# EAGLE design ESP8266-Engine (EAGLE 8.4.0)
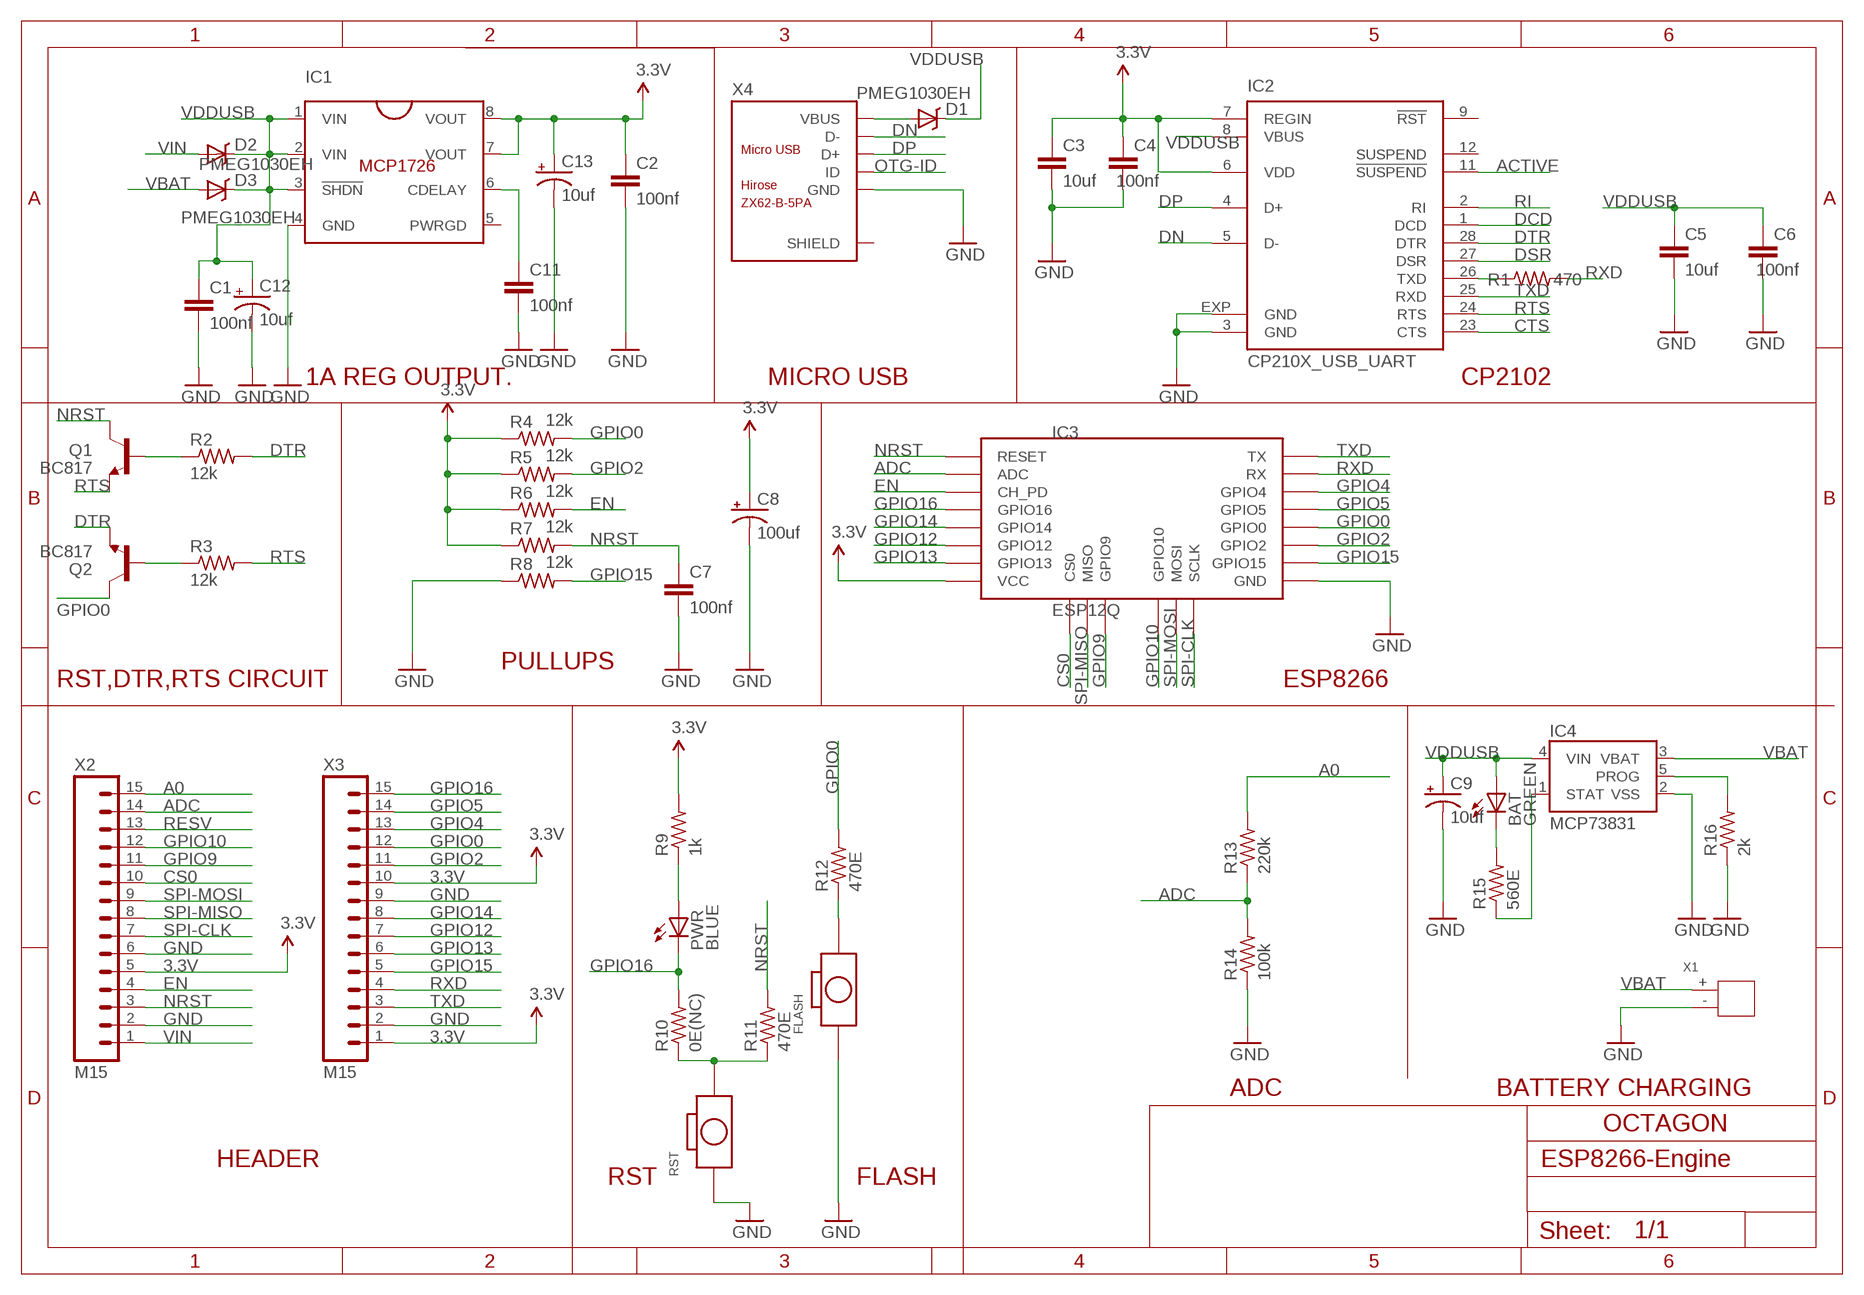
[diagram p0: schematic, sheet 1]

## Parts
BAT  GREEN  LED0603  [LED-0603]
C1  100nf  C-EUC0402  [C0402]
C2  100nf  C-EUC0402  [C0402]
C3  10uf  CAPACITOR-NONPOLARIZEDSMD  [C0603]
C4  100nf  C-EUC0402  [C0402]
C5  10uf  CAPACITOR-NONPOLARIZEDSMD  [C0603]
C6  100nf  C-EUC0402  [C0402]
C7  100nf  C-EUC0402  [C0402]
C8  100uf  CAPACITOR_POLARIZED1206  [EIA3216]
C9  10uf  CAPACITOR_POLARIZED1206  [EIA3216]
C11  100nf  C-EUC0402  [C0402]
C12  10uf  CAPACITOR_POLARIZED1206  [EIA3216]
C13  10uf  CAPACITOR_POLARIZED1206  [EIA3216]
D1  PMEG1030EH  SCHOTTKYDIODEDIOB  [MINIMELF]
D2  PMEG1030EH  SCHOTTKYDIODEDIOB  [MINIMELF]
D3  PMEG1030EH  SCHOTTKYDIODEDIOB  [MINIMELF]
FLASH  SMD-BUTTON-WITHOUT-BOSS-(2P-3X2.5MM)  [SW2-SMD-3.0X2.5X1.2+0.4MM]
IC1  MCP1726  [SOIC8]
IC2  CP210X_USB_UART  [MLP28]
IC3  ESP12Q  [ESP12Q]
IC4  MCP73831  [SOT23-5]
PWR  BLUE  LED0603  [LED-0603]
Q1  BC817  TRANSISTOR_NPNSOT23  [SOT23]
Q2  BC817  TRANSISTOR_NPNSOT23  [SOT23]
R1  470  R-US_R0402  [R0402]
R2  12k  R-US_R0402  [R0402]
R3  12k  R-US_R0402  [R0402]
R4  12k  R-US_R0402  [R0402]
R5  12k  R-US_R0402  [R0402]
R6  12k  R-US_R0402  [R0402]
R7  12k  R-US_R0402  [R0402]
R8  12k  R-US_R0402  [R0402]
R9  1k  R-US_R0402  [R0402]
R10  0E(NC)  R-US_R0402  [R0402]
R11  470E  R-US_R0402  [R0402]
R12  470E  R-US_R0402  [R0402]
R13  220k  R-US_R0402  [R0402]
R14  100k  R-US_R0402  [R0402]
R15  560E  R-US_R0402  [R0402]
R16  2k  R-US_R0402  [R0402]
RST  SMD-BUTTON-WITHOUT-BOSS-(2P-3X2.5MM)  [SW2-SMD-3.0X2.5X1.2+0.4MM]
X1  DIP-JST-2P-2.0  [H2-2.0-6X4.5MM]
X2  M15  [1X15]
X3  M15  [1X15]
X4  MICRO-USB-SMD(ZX62-B-5PA)  [MICRO-USB5+6P-SMD-0.65-AB]

## Nets
3.3V: C2.1 C3.1 C4.1 C8.A(+) C13.A(+) IC1.7(VOUT) IC1.8(VOUT) IC2.6(VDD) IC2.7(REGIN) IC3.VCC R4.1 R5.1 R6.1 R7.1 R9.2 X2.5 X3.1 X3.10
A0: R13.2 X2.15
ACTIVE: IC2.11(!SUSPEND)
ADC: IC3.ADC R13.1 R14.2 X2.14
CS0: IC3.CS0 X2.10
CTS: IC2.23(CTS)
DCD: IC2.1(DCD)
DN: IC2.5(D-) X4.2(D-)
DP: IC2.4(D+) X4.3(D+)
DSR: IC2.27(DSR)
DTR: IC2.28(DTR) Q2.2(E) R2.2
EN: IC3.EN(CH_PD) R6.2 X2.4
GND: C1.2 C2.2 C3.2 C4.2 C5.2 C6.2 C7.2 C8.C(-) C9.C(-) C11.2 C12.C(-) C13.C(-) FLASH.1 IC1.4(GND) IC2.3(GND) IC2.EXP(GND) IC3.GND IC4.2(VSS) R8.1 R14.1 R16.1 RST.1 X1.- X2.2 X2.6 X3.2 X3.9 X4.5(GND)
GPIO0: IC3.GPIO0 Q2.3(C) R4.2 R12.2 X3.12
GPIO2: IC3.GPIO2 R5.2 X3.11
GPIO4: IC3.GPIO4 X3.13
GPIO5: IC3.GPIO5 X3.14
GPIO9: IC3.GPIO9 X2.11
GPIO10: IC3.GPIO10 X2.12
GPIO12: IC3.GPIO12 X3.7
GPIO13: IC3.GPIO13 X3.6
GPIO14: IC3.GPIO14 X3.8
GPIO15: IC3.GPIO15 R8.2 X3.5
GPIO16: IC3.GPIO16 PWR.C R10.2 X3.15
N$1: Q1.1(B) R2.1
N$2: IC2.26(TXD) R1.1
N$3: Q2.1(B) R3.1
N$4: BAT.C R15.2
N$5: IC4.1(STAT) R15.1
N$6: FLASH.2 R12.1
N$8: PWR.A R9.1
N$10: R10.1 R11.1 RST.2
N$11: IC4.5(PROG) R16.2
N$15: C11.1 IC1.6(CDELAY)
NRST: C7.1 IC3.RESET Q1.3(C) R7.2 R11.2 X2.3
OTG-ID: X4.4(ID)
RESV: X2.13
RI: IC2.2(RI)
RTS: IC2.24(RTS) Q1.2(E) R3.2
RXD: IC3.RX R1.2 X3.4
SPI-CLK: IC3.SCLK X2.7
SPI-MISO: IC3.MISO X2.8
SPI-MOSI: IC3.MOSI X2.9
TXD: IC2.25(RXD) IC3.TX X3.3
VBAT: D3.A IC4.3(VBAT) X1.+
VBUS: D1.A X4.1(VBUS)
VDDUSB: BAT.A C1.1 C5.1 C6.1 C9.A(+) C12.A(+) D1.K(C) D2.K(C) D3.K(C) IC1.1(VIN) IC1.2(VIN) IC1.3(!SHDN) IC2.8(VBUS) IC4.4(VIN)
VIN: D2.A X2.1
Unconnected: IC1.5(PWRGD) IC2.9(!RST) IC2.12(SUSPEND) X4.P1(SHIELD) X4.P2(SHIELD) X4.P3(SHIELD) X4.P4(SHIELD) X4.P5(SHIELD) X4.P6(SHIELD)

## Notes on the sheet
- 1A REG OUTPUT. | MICRO USB | CP2102
- PULLUPS
- RST,DTR,RTS CIRCUIT | ESP8266
- ADC | BATTERY CHARGING
- OCTAGON
- HEADER
- RST | FLASH

## Library data of the parts
BAT PWR = Entesla-lib-Aug2010:LED: LEDs Standard schematic elements and footprints for 5mm, 3mm, 1206, and 0603 sized LEDs. 5mm - Spark Fun Electronics SKU : COM-00529 (and others)
C1 C2 C4 C6 C7 C11 = rcl:C-EU: CAPACITOR, European symbol
C3 C5 = Entesla_Kanni:CAPACITOR-NONPOLARIZED: CAPACITOR, European symbol,Non Polarized Capacitors
C8 C9 C12 C13 = Entesla_Kanni:CAPACITOR_POLARIZED: Capacitor Polarized These are commonly used SMD and PTH capacitors. Verify the external diameter of the through hole, as it may vary with manufacturer.
D1-D3 = Entesla_Kanni:SCHOTTKYDIODE: SCHOTTKY DIODE
FLASH RST = Seeed-OPL-Button:SMD-BUTTON-WITHOUT-BOSS-(2P-3X2.5MM): 311020047; MPN: B3U-1000P
IC1 = Entesla_Kanni:MCP1726
IC2 = Entesla_Kanni:CP210X_USB_UART: Single-Chip USB to UART Bridge Source: www.silabs.com .. CP2101.pdf / cp2102.pdf.
IC3 = esp826612q:ESP12Q: ESP8266 Wifi module 12-Q
IC4 = SparkFun-PowerIC:MCP73831: Miniature single cell, fully integrated Li-Ion, Li-polymer charge management controller http://ww1.microchip.com/downloads/en/DeviceDoc/21984a.pdf IC-09995; PROD_ID: IC-09995
Q1 Q2 = Entesla_Kanni:TRANSISTOR_NPN: Transistor NPN BJT configuration in SOT23 package. MMBT2222 is the common NPN we use. Double check BCE configuration again layout.
R1-R16 = Entesla_Kanni:R-US_: RESISTOR, American symbol
X1 = Seeed-OPL-Connector:DIP-JST-2P-2.0: 320110049
X2 X3 = male connector:M15: Header 15 Standard 15-pin 0.1" header. Use with straight break away headers (SKU : PRT-00116), right angle break away headers (PRT-00553), swiss pins (PRT-00743), machine pins (PRT-00117), and female headers (PRT-00115).
X4 = Seeed-OPL-Connector:MICRO-USB-SMD(ZX62-B-5PA): 320010005

## Board
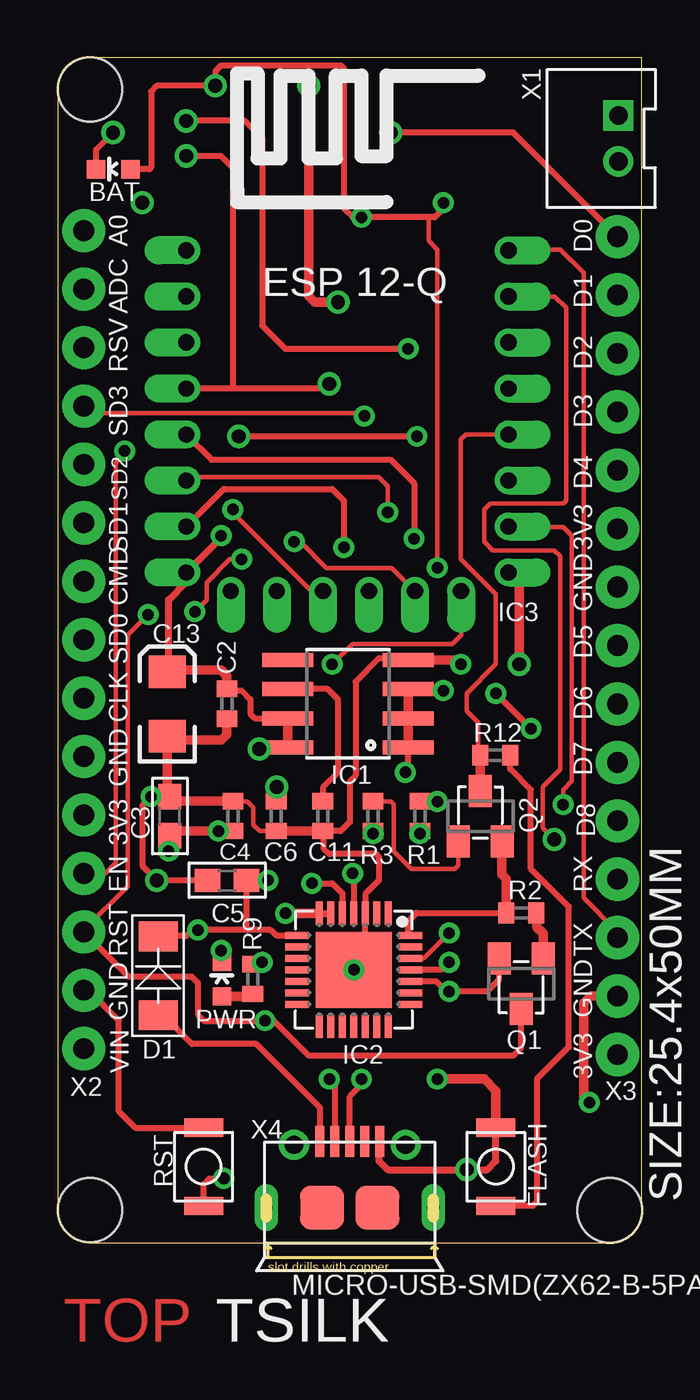
[diagram p1: board, top side]
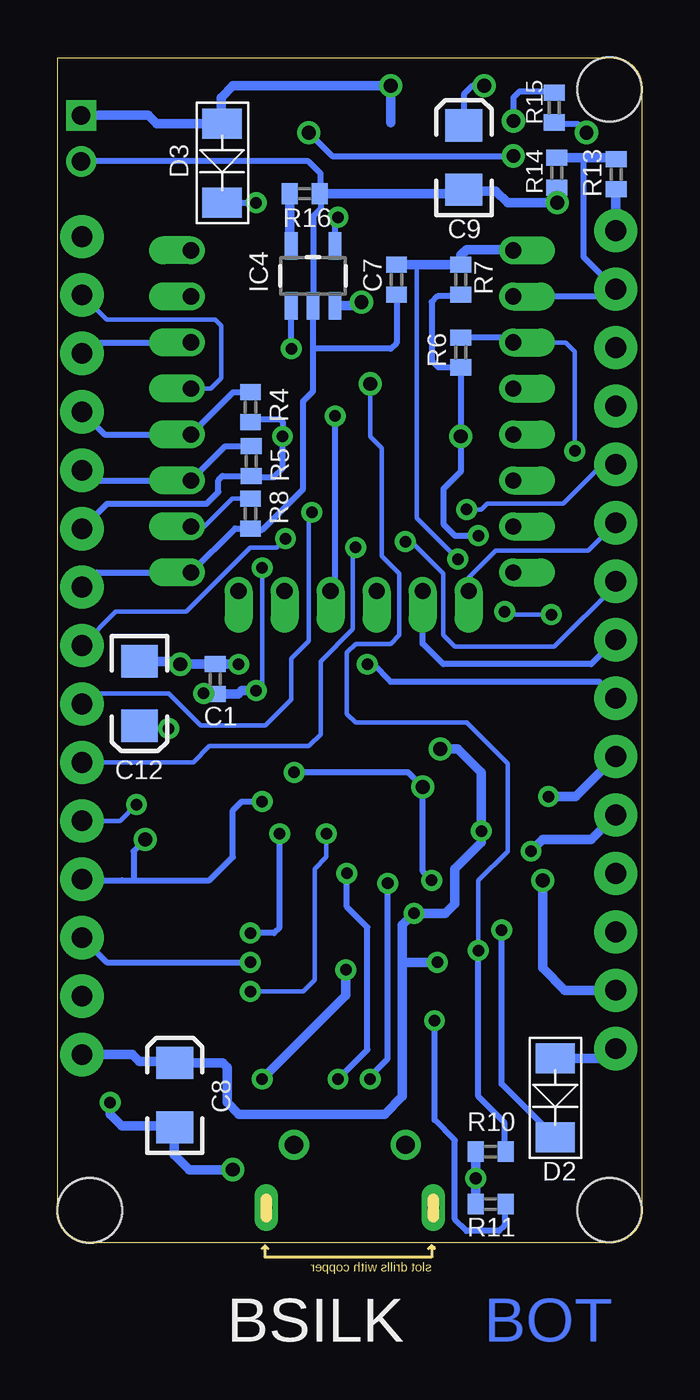
[diagram p2: board, bottom side, seen from below]

Size 25.4 x 51.52 mm. Coordinates in mm from the lower left corner, seen from the top.
Outline: 0,50.23 0,1.37 arc90 1.37,0 24.05,0 arc90 25.4,1.35 25.4,51.52 1.29,51.52 arc90 0,50.23
Copper layers (1*16): Top 0.035mm / dielectric 1.5mm / Bottom 0.035mm
Design rules "default": minimum track width 10mil, minimum drill 24mil, track to track 8mil, track to pad 8mil, pad to pad 8mil, via to via 8mil, smd to smd 8mil, copper to edge 40mil, drill to drill 8mil, minimum pad ring 10mil, minimum via ring 8mil, stop-mask expansion 4mil, vias tented up to drill 0mil, thermal gap 10mil
Holes 2.8 mm at 24,1.41 1.41,1.42 1.41,50.14

### Footprints (pad centres in the part's own frame; a part is rotated, then mirrored left to right if it is on the bottom)
LED-0603 = smd 0.8 x 0.8: A 0,-0.75; C 0,0.75
C0402 = smd 0.7 x 0.9: 1 -0.65,0; 2 0.65,0
C0603 = smd 1.1 x 1: 1 -0.85,0; 2 0.85,0
EIA3216 = smd 1.4 x 1.6: A 1.4,0; C -1.4,0
MINIMELF = smd 1.3 x 1.7: A 0.749,0.953; K 4.178,0.953
SW2-SMD-3.0X2.5X1.2+0.4MM = smd 0.8 x 1.7: 1 -1.7,0; 2 1.7,0
SOIC8 = smd 0.61 x 2.21: 1 -1.905,-2.616; 2 -0.635,-2.616; 3 0.635,-2.616; 4 1.905,-2.616; 5 1.905,2.616; 6 0.635,2.616; 7 -0.635,2.616; 8 -1.905,2.616
MLP28 = smd 1.016 x 0.3: 1 0.081,4.04; 2 0.081,3.54; 3 0.081,3.04; 4 0.081,2.54; 5 0.081,2.04; 6 0.081,1.54; 7 0.081,1.04; 15 4.999,1.04; 16 4.999,1.54; 17 4.999,2.04; 18 4.999,2.54; 19 4.999,3.04; 20 4.999,3.54; 21 4.999,4.04 | smd 0.3 x 1.016: 8 1.04,0.081; 9 1.54,0.081; 10 2.04,0.081; 11 2.54,0.081; 12 3.04,0.081; 13 3.54,0.081; 14 4.04,0.081; 22 4.04,4.999; 23 3.54,4.999; 24 3.04,4.999; 25 2.54,4.999; 26 2.04,4.999; 27 1.54,4.999; 28 1.04,4.999 | smd 3.3 x 3.302: EXP 2.54,2.54
ESP12Q = drill 0.7 offset: ADC -7.1,3.8; CS0 -5.165,-9.005; EN -7.1,1.8; GND 6.9,-8.2; GPIO0 6.9,-2.2; GPIO2 6.9,-4.2; GPIO4 6.9,1.8; GPIO5 6.9,-0.2; GPIO9 -1.165,-9.005; GPIO10 0.835,-9.005; GPIO12 -7.1,-4.2; GPIO13 -7.1,-6.2; GPIO14 -7.1,-2.2; GPIO15 6.9,-6.2; GPIO16 -7.1,-0.2; MISO -3.165,-9.005; MOSI 2.835,-9.005; RESET -7.1,5.8; RX 6.9,3.8; SCLK 4.835,-9.005; TX 6.9,5.8; VCC -7.1,-8.2
SOT23-5 = smd 0.55 x 1.2: 1 -0.95,-1.3; 2 0,-1.3; 3 0.95,-1.3; 4 0.95,1.3; 5 -0.95,1.3
SOT23 = smd 1 x 1.4: 1 -0.95,-1.1; 2 0.95,-1.1; 3 0,1.1
R0402 = smd 0.7 x 0.9: 1 -0.65,0; 2 0.65,0
H2-2.0-6X4.5MM = drill 0.8 pad 1.3 square: + -1,0.75 | drill 0.8 pad 1.3: - 1,0.75
1X15 = drill 0.9 pad 1.88: 1 0,0; 2 2.54,0; 3 5.08,0; 4 7.62,0; 5 10.16,0; 6 12.7,0; 7 15.24,0; 8 17.78,0; 9 20.32,0; 10 22.86,0; 11 25.4,0; 12 27.94,0; 13 30.48,0; 14 33.02,0; 15 35.56,0
MICRO-USB5+6P-SMD-0.65-AB = smd 0.4 x 1.35: 1 -1.3,2.875; 2 -0.65,2.875; 3 0,2.875; 4 0.65,2.875; 5 1.3,2.875 | smd 1.9 x 1.9: P1 -1.2,0; P2 1.2,0 | drill 0.508 pad 1.016 long: P3 -3.625,0; P4 3.625,0 | drill 0.8: P5 -2.425,2.73; P6 2.425,2.73

### Placement (x,y rotation side)
BAT  2.42,46.66 90 top
C1  18.54,24.51 90 bottom
C2  7.36,23.43 270 top
C3  4.88,18.54 90 top
C4  7.62,18.54 90 top
C5  7.37,15.75 180 top
C6  9.51,18.54 270 top
C7  10.67,41.86 270 bottom
C8  20.31,6.41 90 bottom
C9  7.74,47.17 90 bottom
C11  11.53,18.54 270 top
C12  21.83,23.88 270 bottom
C13  4.77,23.42 90 top
D1  5.33,9.14 90 top
D2  4.73,8.76 270 bottom
D3  19.2,49.4 270 bottom
FLASH  19.05,3.3 270 top
IC1  12.62,23.43 90 top
IC2  10.33,14.4 270 top
IC3  12.7,37.34 0 top
IC4  14.3,42.03 0 bottom
PWR  7.14,11.46 0 top
Q1  20.15,11.26 180 top
Q2  18.37,18.54 0 top
R1  15.75,18.54 90 top
R2  20.15,14.34 180 top
R3  13.72,18.54 270 top
R4  17.02,36.32 90 bottom
R5  16.98,33.98 90 bottom
R6  7.87,38.7 90 bottom
R7  7.87,41.86 90 bottom
R8  17.02,31.7 90 bottom
R9  8.49,11.46 90 top
R10  6.58,3.96 0 bottom
R11  6.58,1.67 0 bottom
R12  19.02,21.19 180 top
R13  1.12,46.45 270 bottom
R14  3.71,46.51 90 bottom
R15  3.81,49.35 270 bottom
R16  14.66,45.6 180 bottom
RST  6.35,3.3 270 top
X1  23.62,48.01 270 top
X2  1.14,8.43 90 top
X3  24.33,8.18 90 top
X4  12.7,1.52 0 top

### Tracks (layer width: path | path; a pad name or v marks a point on that pad's centre or on a via)
3.3V  (via drill 0.5, 0.6)
  Top 0.203: 7.11,30.65 v7.11,30.73
  Top 0.254: IC2.7 | C13.A 4.84,24.89 4.83,24.91 | R9.2 8.57,12.19 | IC1.8 9.95,21.46 | v15.62,35.05 v7.87,35.05 | C2.1 7.44,24 8,24 8.38,23.62 8.38,22.99 8.57,22.8 IC1.7
  Top 0.305: C3.1 5.08,17.89 | IC2.7 IC2.6 | 4.83,24.91 4.83,27.94 5.6,28.71 IC3.VCC 7.11,30.65
  Top 0.406: 5.08,17.89 v6.99,17.89 C4.1 | v9.91,14.32 IC2.7 | IC1.8 IC1.7 | 4.84,24.89 7.11,24.89 7.36,24.64 C2.1 | 8.57,12.19 v8.89,12.19 | 9.95,21.46 v8.76,21.46 | v4.83,17.02 4.88,17.07 C3.1
  Bottom 0.203: R4.1 16.88,35.81 | R5.1 16.93,33.27
  Bottom 0.254: X3.10 23.24,32.13 18.92,32.13 18.41,32.64 18.41,33.15 18.23,33.33 R5.1 | R7.1 7.94,41.15 8.89,41.15 9.14,40.89 9.14,38.35 8.84,38.05 R6.1 v7.87,35.05 7.87,33.53 8.64,32.77 8.64,31.24 8.13,30.73 v7.11,30.73 | 16.88,35.81 15.75,35.81 15.62,35.69 v15.62,35.05 15.62,33.66 16,33.27 16.93,33.27
  Bottom 0.406: 10.41,12.19 10.41,6.35 11.18,5.59 17.53,5.59 18.03,6.1 18.03,7.62 18.23,7.81 C8.A 20.37,7.87 21.84,7.87 22.15,8.18 X3.1 | v8.89,12.19 10.41,12.19 | v8.76,21.46 8,21.46 6.99,20.45 v6.99,17.89 6.99,17.4 8.13,16.26 8.13,14.73 8.54,14.32 v9.91,14.32 10.41,13.81 10.41,12.19 | X2.5 2.21,17.53 4.32,17.53 v4.83,17.02
A0
  Bottom 0.406: R13.2 1.14,45.78 X2.15
ADC
  Bottom 0.254: IC3.ADC 1.46,41.14 X2.14 2.54,42.85 2.54,47.16
  Bottom 0.406: R13.1 1.18,47.16 2.54,47.16 R14.2
CS0
  Bottom 0.203: X2.10 2.34,30.1 6.35,30.1 7.54,28.91 IC3.CS0
DN  (via drill 0.5)
  Top 0.254: 12.06,4.41 X4.2 12.05,6.87 v11.81,7.11 | IC2.5 12.37,15.19 11.94,15.62 v11.05,15.62
  Bottom 0.254: v11.05,15.62 11.05,8 11.81,7.24 v11.81,7.11
DP  (via drill 0.5)
  Top 0.254: X4.3 12.7,6.35 13.21,6.86 v13.21,7.11 | IC2.4 12.87,16.08 12.85,16.05 v12.83,16.05
  Bottom 0.254: v13.21,7.11 11.94,8.38 11.94,13.72 12.83,14.61 v12.83,16.05
DTR
  Top 0.254: Q2.2 19.3,17.42 | IC2.28 15.24,13.46 15.24,13.97 15.61,14.34 R2.2
  Top 0.406: 19.3,17.42 19.3,16 19.5,15.8 R2.2
EN  (via drill 0.5)
  Top 0.203: X2.4 2.08,16.05 2.54,16.51 2.54,33.91 2.92,34.29 v2.92,34.42
  Bottom 0.203: v2.92,34.42 2.92,38.73 3.32,39.14 IC3.EN
  Bottom 0.254: R6.2 5.82,39.35 IC3.EN
GND  (via drill 0.5, 0.6)
  Top 0.203: 7.63,19.18 8.26,19.18 8.51,18.92 8.51,18.16 8.78,17.89 C6.2
  Top 0.254: 4.77,19.5 C3.2 v4.06,19.39 3.68,19.01 3.68,16.38 v4.32,15.75 C5.2 | C13.C 4.95,21.84 | IC2.EXP 13.37,12.36 IC2.3 13.37,15.15 13.97,15.75 13.97,16.76 13.84,16.89 11.81,16.89 11.56,17.14 11.56,17.86 C11.2 12.3,17.89 12.7,18.29 12.7,20.07 12.95,20.32 12.95,24.38 13.97,25.4 15.18,25.4 IC1.4 | C4.2 7.63,19.18 | X2.2 1.35,10.97 2.67,9.65 2.67,5.71 3.38,5 RST.1
  Top 0.305: C3.2 5.08,19.19 | X4.5 13.97,4.37 13.97,3.56 14.35,3.17 v17.78,3.17 18.67,3.17 19.05,3.56 FLASH.1
  Top 0.406: 5.08,19.19 C4.2 | C11.2 C6.2 | 4.77,19.5 C13.C | 4.95,21.84 7.11,21.84 7.36,22.09 C2.2 | v16.51,7.11 18.54,7.11 19.05,6.6 FLASH.1 | X3.2 23.16,10.72 22.86,10.41 22.86,6.35 v23.11,6.1 | v17.53,25.15 17.34,25.34 IC1.4 | IC3.GND 20.07,28.67 v20.07,25.15
  Bottom 0.203: C1.2 18.55,25.15 | R8.1 16.95,30.99
  Bottom 0.254: C7.2 10.67,39.12 10.92,38.86 14.3,38.86 | 14.3,38.86 IC4.2 14.3,44.63 13.97,44.96 13.97,45.56 R16.1 13.97,45.64 13.97,46.48 14.49,47.01 X1.- | C1.2 18.53,25.15 | C9.C 7.69,45.72 | X3.9 23.69,29.14 IC3.GND 17.69,31.05 R8.1 | 16.95,30.99 16.51,30.99 14.73,32.77 14.73,36.58 14.3,37.01 14.3,38.86
  Bottom 0.406: v16.51,7.11 12.87,10.75 IC2.EXP | 18.53,25.15 v17.53,25.15 | X2.6 2.88,19.39 v4.06,19.39 | v4.32,15.75 4.32,11.94 3.35,10.97 X2.2 | 18.55,25.15 v20.07,25.15 20.2,25.28 C12.C | 7.69,45.72 6.35,45.72 5.84,45.21 v3.68,45.21 3.68,45.84 R14.1 | v17.78,3.17 19.68,3.17 20.32,3.81 C8.C 20.38,5.08 22.61,5.08 23.11,5.59 v23.11,6.1 | C9.C 7.91,45.6 R16.1
  other vias: 12.87,11.86
GPIO0
  Top 0.203: R12.2 18.29,21.27 18.29,22.61 17.78,23.11 17.78,23.88 19.05,25.15 19.05,28.19 17.53,29.72 17.53,34.92 17.74,35.14 IC3.GPIO0
  Top 0.254: Q2.3
  Top 0.406: Q2.3 R12.2
  Bottom 0.254: X3.12 23.35,35.14 IC3.GPIO0 17.77,36.97 R4.2
GPIO2
  Bottom 0.254: X3.11 23.89,33.14 IC3.GPIO2 18.11,34.63 R5.2
GPIO4
  Bottom 0.254: X3.13 23.85,39.14 IC3.GPIO4
GPIO5
  Bottom 0.203: X3.14 23.27,40.13 18.54,40.13 18.29,39.88 18.29,37.59 18.74,37.14 IC3.GPIO5
GPIO9  (via drill 0.5)
  Top 0.203: IC3.GPIO9 11.04,28.33 7.62,31.75 v7.62,31.88
  Bottom 0.203: v7.62,31.88 6.99,31.88 6.73,32.13 3.43,32.13 1.73,33.83 X2.11
GPIO10  (via drill 0.5)
  Top 0.203: X2.12 1.45,36.07 13.21,36.07 v13.34,35.94
  Bottom 0.254: IC3.GPIO10 13.34,28.53 v13.34,35.94
GPIO12  (via drill 0.5)
  Top 0.203: IC3.GPIO12 5.74,33.27 13.97,33.27 14.35,32.89 v14.35,31.75
  Bottom 0.203: X3.7 23.88,23.88 20.57,23.88 19.18,22.48 16.38,22.48 15.24,23.62 15.24,25.4 14.48,26.16 14.48,31.62 v14.35,31.75
GPIO13  (via drill 0.5)
  Top 0.254: IC3.GPIO13 7.23,32.77 11.94,32.77 12.45,32.26 v12.45,30.23
  Bottom 0.203: X3.6 19.51,20.88 18.8,21.59 14.48,21.59 13.97,22.1 13.97,25.27 12.57,26.67 12.57,30.1 v12.45,30.23
GPIO14  (via drill 0.5)
  Top 0.254: IC3.GPIO14 6.7,34.04 14.48,34.04 15.49,33.02 v15.49,30.61
  Bottom 0.203: X3.8 22.86,27.43 19.81,27.43 17.02,30.23 15.88,30.23 v15.49,30.61
GPIO15  (via drill 0.5)
  Top 0.203: IC3.GPIO15 19.62,31.11 21.97,31.11 22.35,30.73 22.35,20.07 21.97,19.68 v21.97,19.05
  Bottom 0.203: v21.97,19.05 22.68,18.34 X3.5 | IC3.GPIO15 19.58,31.11 19.05,31.11 17.81,32.35 R8.2
GPIO16  (via drill 0.5, 0.6)
  Top 0.254: v7.11,12.7 7.14,12.67 PWR.C | X3.15 19.81,48.26 v14.48,48.26 | 7.62,37.14 7.62,46.74 7.11,47.24 v5.59,47.24 | v11.81,37.34 11.61,37.14 7.62,37.14 | 7.62,37.14 IC3.GPIO16
  Bottom 0.203: v7.11,12.7 7.11,15.75 5.84,17.02 5.84,20.83 7.62,22.61 12.45,22.61 12.83,22.99 12.83,25.65 12.45,26.04 10.92,26.04 10.54,26.42 10.54,29.08 11.3,29.84 11.3,34.54 11.81,35.05 v11.81,37.34
  Bottom 0.254: R10.2 5.84,4.04 5.97,4.17 5.97,5.21 7.11,6.35 v7.11,12.7 | v5.59,47.24 13.46,47.24 v14.48,48.26
N$1
  Top 0.254: R2.1 20.83,14.31
  Top 0.406: 20.83,14.31 20.83,13.72 21.1,13.44 Q1.1
N$2  (via drill 0.5)
  Top 0.203: R1.1 v15.75,17.78 | v17.02,13.46 15.92,12.36 IC2.26
  Bottom 0.254: v15.75,17.78 15.75,13.72 16,13.46 v17.02,13.46
N$3
  Top 0.203: R3.1 13.73,19.18 14.48,19.18 14.61,19.05 14.61,17.02 15.37,16.26 17.27,16.26 17.42,16.41 Q2.1
N$4  (via drill 0.6 pad 1.02)
  Top 0.254: v2.41,48.26 1.67,47.52 BAT.C
  Bottom 0.254: R15.2 3.75,48.64 2.79,48.64 v2.41,48.26
N$5  (via drill 0.5, 0.6 pad 1.02)
  Top 0.254: v15.24,38.86 9.91,38.86 8.89,39.88 8.89,48.01 8.13,48.77 v5.59,48.77
  Bottom 0.254: v15.24,38.86 15.25,39.12 IC4.1 | R15.1 3.85,50.04 5.33,50.04 5.59,49.78 v5.59,48.77
N$6
  Top 0.254: 19.13,1.52 FLASH.2 20.65,1.6 20.83,1.78 20.83,7.11 22.23,8.51 22.23,14.61 20.57,16.26 20.57,19.68 19.67,20.59 R12.1
N$8
  Top 0.254: R9.1 8.38,10.71
  Top 0.406: 8.38,10.71 PWR.A
N$10  (via drill 0.51)
  Top 0.254: RST.2 6.35,2.54 6.6,2.79 v7.23,2.79
  Bottom 0.406: 7.24,1.69 R11.1 v7.23,2.79 7.23,3.3 R10.1
N$11
  Bottom 0.254: IC4.5 15.31,43.39
  Bottom 0.406: 15.31,43.39 R16.2
N$15
  Top 0.254: C11.1 11.56,19.22 11.56,19.81 12.19,20.45 12.19,23.62 11.75,24.07 IC1.6
NRST  (via drill 0.5)
  Top 0.203: v3.94,27.3 3.05,26.42 3.05,15.49 1.14,13.59 X2.3 | v5.97,27.43 6.48,27.94 6.48,28.7 7.49,29.72 v8,29.72
  Top 0.254: Q1.3 20.15,8.47 19.81,8.13 10.92,8.13 9.4,9.65 v9.02,9.65 6.35,9.65 6.1,9.91 6.1,11.3 5.84,11.56 3.1,11.56 X2.3
  Bottom 0.203: R7.2 7.91,42.55 | v8,29.72 9.78,31.5 9.78,42.51 | v3.94,27.3 5.84,27.3 v5.97,27.43
  Bottom 0.254: IC3.RESET 5.64,43.18 | R11.2 5.97,1.63 5.97,0.76 6.22,0.51 7.62,0.51 8.13,1.02 8.13,4.45 9.02,5.33 v9.02,9.65
  Bottom 0.406: 5.64,43.18 7.62,43.18 7.87,42.93 R7.2 9.78,42.51 C7.1
RTS  (via drill 0.5)
  Top 0.203: R3.2 v13.72,17.78
  Top 0.254: Q1.2 19.18,12.33 19.18,11.43 18.67,10.92 v17.02,10.92 16.89,10.92 16.45,11.36 IC2.24
  Bottom 0.203: v17.02,10.92 14.73,10.92 14.22,11.43 14.22,16.26 13.72,16.76 v13.72,17.78
RXD  (via drill 0.5, 0.6)
  Top 0.203: v21.59,17.53 21.08,18.03 21.08,19.81 21.84,20.57 21.84,29.84 21.59,30.1 18.92,30.1 18.54,30.48 18.54,31.88 18.8,32.13 21.97,32.13 22.1,32.26 22.1,40.64 21.6,41.14 IC3.RX
  Top 0.254: v16.51,19.18 16.5,19.19 R1.2
  Bottom 0.254: X3.4 24.28,15.75 22.61,15.75 22.1,15.75 | 22.1,15.75 18.8,15.75 17.78,16.76 17.78,18.8 17.4,19.18 v16.51,19.18 | v21.59,17.53 22.1,17.02 22.1,15.75
SPI-CLK  (via drill 0.5)
  Top 0.203: v11.94,25.15 12.83,26.04 17.14,26.04 17.54,26.43 IC3.SCLK
  Bottom 0.254: X2.7 1.85,24.38 10.92,24.38 11.68,25.15 v11.94,25.15
SPI-MISO
  Bottom 0.254: X2.8 2.21,25.15 8.64,25.15 9.54,26.05 IC3.MISO
SPI-MOSI  (via drill 0.5)
  Top 0.203: IC3.MOSI 14.53,29.34 11.68,29.34 10.54,30.48 v10.29,30.48
  Bottom 0.203: X2.9 1.14,28.57 3.81,25.91 8.13,25.91 8.64,26.42 8.64,29.08 10.03,30.48 v10.29,30.48
TXD  (via drill 0.5)
  Top 0.203: IC3.TX 19.64,43.18 21.84,43.18 22.86,42.16 22.86,14.99 24.33,13.51 X3.3
  Top 0.254: v17.02,12.19 16.69,11.86 IC2.25
  Bottom 0.254: X3.3 23.27,12.19 v17.02,12.19
VBAT  (via drill 0.6)
  Top 0.406: v10.92,50.29 10.92,41.15 11.18,40.89 v12.19,40.89
  Bottom 0.254: D3.A
  Bottom 0.406: D3.A 21.08,48.64 21.45,49.01 X1.+ | 10.92,48.69 v10.92,50.29 17.78,50.29 18.29,49.78 18.29,48.69 D3.A | v12.19,40.89 12.36,40.73 IC4.3
VBUS
  Top 0.254: 4.39,9.91 D1.A 4.58,9.89 5.84,8.64 8.64,8.64 11.4,5.87 X4.1
VDDUSB  (via drill 0.5, 0.6)
  Top 0.203: v16.51,29.34 16.51,43.18 16.13,43.56 16.13,44.58
  Top 0.254: C6.1 9.53,19.21 v9.53,19.81 | 15.24,21.08 IC1.1 15.24,20.57 v15.11,20.45 | IC1.3 15.3,24 | 4.32,13.39 D1.K 3.82,13.32 3.81,13.34 | C5.1 8.26,15.71 | 3.81,13.34 5.59,13.34 5.84,13.59 v6.1,13.59 8.26,13.59 | 3.68,13.34 3.81,13.34 | C5.1 v9.14,15.75 | 10.39,13.34 IC2.8 9.5,13.36 9.27,13.59 8.26,13.59 | 8.26,13.59 8.22,13.63 C5.1 | v20.57,22.35 v19.05,23.88 | v16.76,45.21 16.76,44.96 16.38,44.58 16.13,44.58 v13.21,44.58 12.83,44.58 12.45,44.96 12.45,51.05 12.32,51.18 7.11,51.18 6.86,50.93 v6.86,50.29 4.32,50.29 4.06,50.04 4.06,46.74 3.99,46.66 BAT.A 3.3,46.8
  Top 0.406: IC1.1 IC1.2 IC1.3 | 15.3,24 v16.76,24
  Bottom 0.203: IC4.4 13.5,43.18 | v16.51,29.34 16.51,24 | C12.A 21.7,22.61 21.45,22.35 v20.57,22.35 | v19.05,23.88 19.03,23.86
  Bottom 0.254: v6.86,50.29 7.37,50.29 7.74,49.92 C9.A | v13.21,44.58 13.35,44.44 IC4.4 | D3.K v16.76,45.21 | v15.11,20.45 10.16,20.45 v9.53,19.81 9.53,16.13 v9.14,15.75 | v6.1,13.59 6.1,6.9 D2.K
  Bottom 0.406: 16.51,24 v16.76,24 17.4,24 17.55,23.86 C1.1 19.03,23.86
VIN
  Bottom 0.406: X2.1 1.57,8.01 D2.A

### Text on the board
Top: TOP
Bottom: BOT
tPlace: A0 | D0 | D1 | ADC | RSV | D2 | SD3 | D3 | D4 | SD2 | SD1 | 3V3 | CMD | GND | SD0 | D5 | CLK | D6 | GND | D7 | D8 | 3V3 | EN | RX | RST | TX | GND | GND | VIN | 3V3 | SIZE:25.4x50MM | TSILK
bPlace: BSILK
tStop: BSTOP | TSTOP